# EAGLE design Jaseel_eagle_hello (EAGLE 6.5.0)
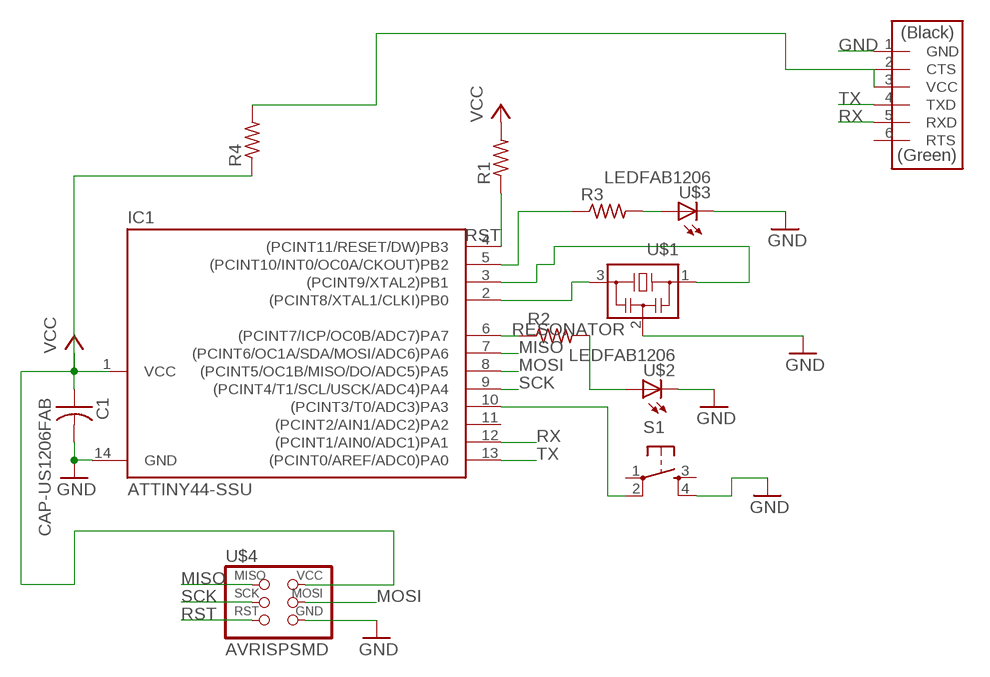
[diagram p0: schematic, sheet 1]

## Parts
C1  CAP-US1206FAB  [C1206FAB]
IC1  ATTINY44-SSU  [SOIC14]
R1  RES-US1206FAB  [R1206FAB]
R2  RES-US1206FAB  [R1206FAB]
R3  RES-US1206FAB  [R1206FAB]
R4  RES-US1206FAB  [R1206FAB]
S1  6MM_SWITCH6MM_SWITCH  [6MM_SWITCH]
U$1  RESONATOR  [EFOBM]
U$2  LEDFAB1206  [LED1206FAB]
U$3  LEDFAB1206  [LED1206FAB]
U$4  AVRISPSMD  [2X03SMD]
U$5  FTDI-SMD-HEADER  [1X06SMD]

## Nets
A7: IC1.6((PCINT7/ICP/OC0B/ADC7)PA7) R2.1
GND: C1.2 IC1.14(GND) S1.4(S1) U$1.2 U$2.2(C) U$3.2(C) U$4.6(GND) U$5.1(GND)
MISO: IC1.7((PCINT6/OC1A/SDA/MOSI/ADC6)PA6) U$4.1(MISO)
MOSI: IC1.8((PCINT5/OC1B/MISO/DO/ADC5)PA5) U$4.4(MOSI)
N$1: IC1.2((PCINT8/XTAL1/CLKI)PB0) U$1.3
N$2: IC1.3((PCINT9/XTAL2)PB1) U$1.1
N$3: R2.2 U$2.1(A)
N$4: R3.2 U$3.1(A)
N$5: R4.2 U$5.3(VCC)
N$6: IC1.5((PCINT10/INT0/OC0A/CKOUT)PB2) R3.1
N$7: U$4.2(VCC)
N$9: IC1.10((PCINT3/T0/ADC3)PA3) S1.2(P1)
RST: IC1.4((PCINT11/RESET/DW)PB3) R1.1 U$4.5(RST)
RX: IC1.12((PCINT1/AIN0/ADC1)PA1) U$5.5(RXD)
SCK: IC1.9((PCINT4/T1/SCL/USCK/ADC4)PA4) U$4.3(SCK)
TX: IC1.13((PCINT0/AREF/ADC0)PA0) U$5.4(TXD)
VCC: C1.1 IC1.1(VCC) R1.2 R4.1
Unconnected: IC1.11((PCINT2/AIN1/ADC2)PA2) S1.1(P) S1.3(S) U$5.2(CTS) U$5.6(RTS)

## Library data of the parts
C1 = fab:CAP-US
IC1 = fab:ATTINY44
R1-R4 = fab:RES-US: Resistor (US Symbol) Variants with postfix FAB are widened to allow the routing of internal traces
S1 = fab:6MM_SWITCH: OMRON SWITCH
U$1 = fab:RESONATOR
U$2 U$3 = fab:LED: LED
U$4 = fab:AVRISP
U$5 = fab:FTDI-SMD-HEADER

## Board
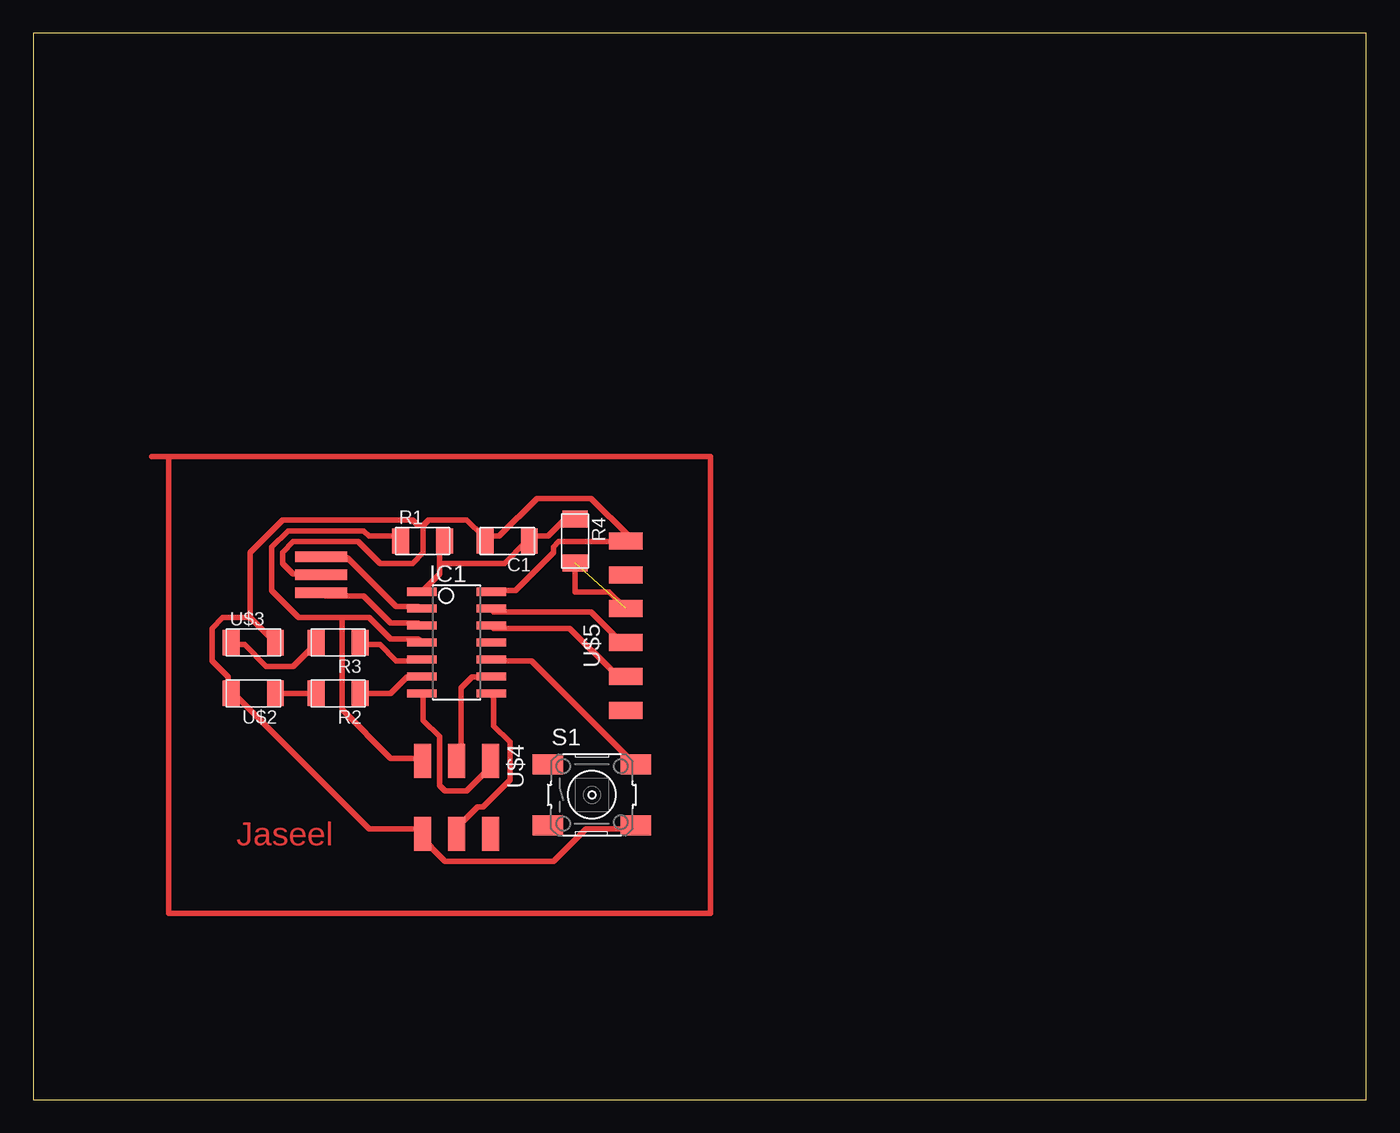
[diagram p1: board, top side]

Size 100 x 80 mm. Coordinates in mm from the lower left corner, seen from the top.
Outline: 0,0 100,0 100,80 0,80 0,0
Copper layers (1*16): Top 0.035mm / dielectric 1.5mm / Bottom 0.035mm
Design rules "default *": minimum track width 20mil, minimum drill 20mil, track to track 20mil, track to pad 20mil, pad to pad 20mil, via to via 20mil, smd to smd 20mil, copper to edge 40mil, drill to drill 8mil, minimum pad ring 10mil, minimum via ring 8mil, stop-mask expansion 4mil, vias tented up to drill 0mil, thermal gap 10mil

### Footprints (pad centres in the part's own frame; a part is rotated, then mirrored left to right if it is on the bottom)
C1206FAB = smd 1.27 x 1.905: 1 -1.651,0; 2 1.651,0
SOIC14 = smd 0.61 x 2.21: 1 -3.81,-2.603; 2 -2.54,-2.603; 3 -1.27,-2.603; 4 0,-2.603; 5 1.27,-2.603; 6 2.54,-2.603; 7 3.81,-2.603; 8 3.81,2.603; 9 2.54,2.603; 10 1.27,2.603; 11 0,2.603; 12 -1.27,2.603; 13 -2.54,2.603; 14 -3.81,2.603
R1206FAB = smd 1.27 x 1.905: 1 -1.651,0; 2 1.651,0
6MM_SWITCH = smd 2.286 x 1.524: 1 -3.302,2.286; 2 3.302,2.286; 3 -3.302,-2.286; 4 3.302,-2.286
EFOBM = smd 0.8 x 3.9: 1 -1.35,0; 2 0,0; 3 1.35,0
LED1206FAB = smd 1.27 x 1.905: 1 -1.651,0; 2 1.651,0
2X03SMD = smd 2.54 x 1.27: 1 -2.54,2.54; 2 2.92,2.54; 3 -2.54,0; 4 2.92,0; 5 -2.54,-2.54; 6 2.92,-2.54
1X06SMD = smd 2.54 x 1.27: 1 0,6.35; 2 0,3.81; 3 0,1.27; 4 0,-1.27; 5 0,-3.81; 6 0,-6.35

### Placement (x,y rotation side)
C1  35.56,41.91 180 top
IC1  31.75,34.29 270 top
R1  29.21,41.91 0 top
R2  22.86,30.48 180 top
R3  22.86,34.29 180 top
R4  40.64,41.91 270 top
S1  41.91,22.86 0 top
U$1  21.59,39.37 90 top
U$2  16.51,30.48 180 top
U$3  16.51,34.29 0 top
U$4  31.75,22.86 270 top
U$5  44.45,35.56 0 top

### Tracks (layer width: path | path; a pad name or v marks a point on that pad's centre or on a via)
A7
  Top 0.406: R2.1 26.82,30.48 28.04,31.7 28.85,31.7 IC1.6
GND
  Top 0.406: IC1.14 34.54,38.2 36.17,38.2 39.01,41.05 39.01,41.45 39.42,41.86 44.3,41.86 U$5.1 44.7,42.27 41.86,45.11 37.8,45.11 34.95,42.27 34.14,42.27 C1.2 33.73,42.27 32.51,43.48 29.67,43.48 29.26,43.08 | 29.26,43.08 29.26,41.05 28.45,40.23 26.01,40.23 24.38,41.86 19.51,41.86 18.69,41.05 18.69,40.23 19.51,39.42 21.54,39.42 U$1.2 | 16.26,36.17 14.22,36.17 13.41,35.36 13.41,32.92 14.63,31.7 14.63,30.48 U$2.2 15.04,30.48 25.2,20.32 28.85,20.32 U$4.6 28.85,19.91 30.89,17.88 39.01,17.88 41.45,20.32 45.11,20.32 S1.4 | 16.26,36.17 17.88,34.54 U$3.2 | 29.26,43.08 28.85,43.08 28.45,43.48 18.69,43.48 16.26,41.05 16.26,36.17
MISO
  Top 0.406: IC1.7 29.26,30.48 29.26,28.45 30.48,27.23 30.48,23.57 30.89,23.16 32.51,23.16 34.54,25.2 U$4.1
MOSI
  Top 0.406: IC1.8 34.54,30.48 34.54,28.04 35.76,26.82 35.76,23.98 33.73,21.95 33.33,21.95 31.7,20.32 U$4.4
N$1
  Top 0.406: IC1.2 28.85,36.98 27.23,36.98 23.57,40.64 21.95,40.64 U$1.3
N$2
  Top 0.406: IC1.3 28.85,35.76 26.82,35.76 24.79,37.8 21.95,37.8 U$1.1
N$3
  Top 0.406: R2.2 U$2.1
N$4
  Top 0.406: U$3.1 15.04,34.14 15.85,34.14 17.48,32.51 19.51,32.51 21.13,34.14 R3.2
N$5  (1 unrouted)
N$6
  Top 0.406: R3.1 24.79,34.14 26.01,34.14 27.23,32.92 28.85,32.92 IC1.5
N$8
  Top 0.406: 40.64,40.64 40.64,38.1 43.18,38.1 44.45,36.83
N$9
  Top 0.406: IC1.10 34.54,32.92 37.39,32.92 45.11,25.2 S1.2
N$10
  Top 0.406: 10.16,48.26 50.8,48.26 50.8,13.97 10.16,13.97 10.16,48.26 | 8.89,48.26 10.16,48.26
RST
  Top 0.406: 23.16,36.17 25.2,36.17 26.82,34.54 28.85,34.54 IC1.4 | 23.16,36.17 19.91,36.17 17.88,38.2 17.88,41.45 19.1,42.67 24.79,42.67 25.2,42.27 27.23,42.27 R1.1 | 23.16,36.17 23.16,29.26 26.82,25.6 28.85,25.6 U$4.5
RX
  Top 0.406: IC1.12 34.54,35.36 40.23,35.36 43.48,32.11 44.3,32.11 U$5.5
SCK
  Top 0.406: IC1.9 34.14,31.7 32.92,31.7 32.11,30.89 32.11,25.6 U$4.3
TX
  Top 0.406: IC1.13 34.54,36.58 41.86,36.58 44.3,34.14 U$5.4
VCC
  Top 0.406: R4.1 40.64,43.48 39.83,43.48 38.61,42.27 37.39,42.27 C1.1 36.98,41.86 35.36,40.23 30.48,40.23 | 30.48,40.23 30.48,39.42 29.26,38.2 IC1.1 | 30.48,40.23 30.48,41.86 R1.2

### Text on the board
Top: Jaseel